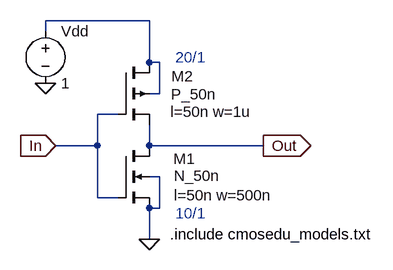
[diagram p0: schematic Inverter.asc]
Inverter.asc, the LTspice schematic file:
Version 4
SHEET 1 1136 680
WIRE 448 -368 288 -368
WIRE 288 -352 288 -368
WIRE 448 -304 448 -368
WIRE 464 -304 448 -304
WIRE 464 -256 464 -304
WIRE 464 -256 448 -256
WIRE 400 -224 368 -224
WIRE 368 -176 368 -224
WIRE 368 -176 304 -176
WIRE 448 -176 448 -208
WIRE 624 -176 448 -176
WIRE 464 -128 448 -128
WIRE 368 -96 368 -176
WIRE 400 -96 368 -96
WIRE 464 -80 464 -128
WIRE 464 -80 448 -80
WIRE 448 -32 448 -80
FLAG 304 -176 In
IOPIN 304 -176 In
FLAG 624 -176 Out
IOPIN 624 -176 Out
FLAG 448 -32 0
FLAG 288 -272 0
SYMBOL nmos4 400 -176 R0
WINDOW 0 119 20 Right 2
WINDOW 3 157 46 Right 2
WINDOW 123 238 76 Right 2
SYMATTR InstName M1
SYMATTR Value N_50n
SYMATTR Value2 l=50n w=500n
SYMBOL pmos4 400 -304 R0
WINDOW 0 116 21 Right 2
WINDOW 3 151 49 Right 2
WINDOW 123 206 76 Right 2
SYMATTR InstName M2
SYMATTR Value P_50n
SYMATTR Value2 l=50n w=1u
SYMBOL voltage 288 -368 R0
SYMATTR InstName Vdd
SYMATTR Value 1
TEXT 488 -312 Left 2 ;20/1
TEXT 488 -72 Left 2 ;10/1
TEXT 480 -40 Left 2 !.include cmosedu_models.txt

The netlist it stands for:
* Inverter.asc
M1 Out In 0 0 N_50n l=50n w=500n
M2 N001 In Out N001 P_50n l=50n w=1u
Vdd N001 0 1
.model NMOS NMOS
.model PMOS PMOS
.lib standard.mos
* 20/1
* 10/1
.include cmosedu_models.txt
.backanno
.end